# Altium project BY-IOM-v0.2.PrjPCB
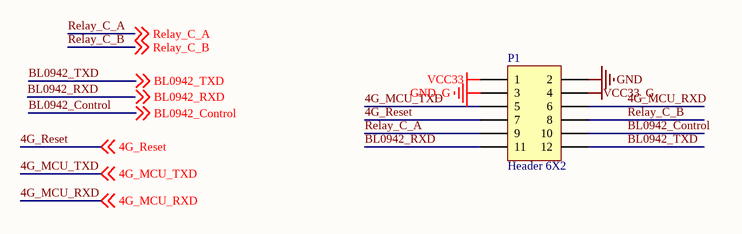
[diagram p0: 连接.SchDoc]
4 sheets, 54 parts. Net scope: global (net labels, ports and power ports of the same name join across sheets).
Board file: Power.PcbDoc
Sheets:
  连接.SchDoc
  Power.SchDoc
  继电器.SchDoc
  4G.SchDoc

## Sheet 连接.SchDoc
size A4

### Parts
P1  Header 6X2  [HDR2X6]

### Nets
GND: P1.2
GND_G: P1.3
VCC33: P1.1
VCC33_G: P1.4
4G_MCU_RXD: P1.6 ; off-sheet 4G_MCU_RXD
4G_MCU_TXD: P1.5 ; off-sheet 4G_MCU_TXD
4G_Reset: P1.7 ; off-sheet 4G_Reset
BL0942_Control: P1.10 ; off-sheet BL0942_Control
BL0942_RXD: P1.11 ; off-sheet BL0942_RXD
BL0942_TXD: P1.12 ; off-sheet BL0942_TXD
Relay_C_A: P1.9 ; off-sheet Relay_C_A
Relay_C_B: P1.8 ; off-sheet Relay_C_B

### Notes on the sheet
- Labels drawn without touching a wire or pin: BL0942_RXD

### Library data of the parts
P1 = Header 6X2: Header, 6-Pin, Dual row; LatestRevisionDate: 17-Jul-2002; LatestRevisionNote: Re-released for DXP Platform.; Publisher: Altium Limited

## Sheet Power.SchDoc
size A4
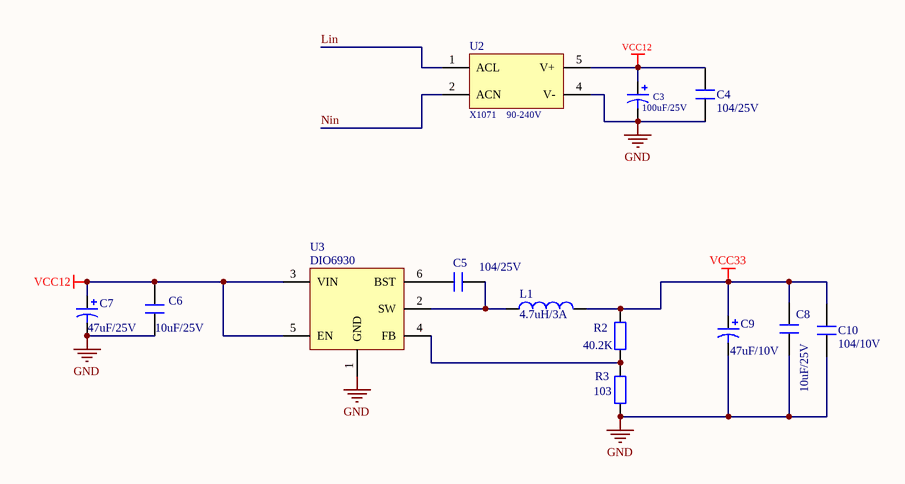
[diagram p1: Power.SchDoc]

### Parts
C3  100uF/25V  [CAPPIND06]
C4  104/25V  [0603R]
C5  104/25V  [0603R]
C6  10uF/25V  [0603R]
C7  47uF/25V  [0805R]
C8  10uF/25V  [0603R]
C9  47uF/10V  [0805R]
C10  104/10V  [0603R]
L1  4.7uH/3A  [贴片电感5020]
R2  40.2K  [0603R]
R3  103  [0603R]
U2  X1071    90-240V  [X1071]
U3  DIO6930  [SOT-23-6DBV]

### Nets
GND: C3.2 C4.1 C6.1 C7.2 C8.1 C9.2 C10.1 R3.2 U2.4(V-) U3.1(GND)
VCC12: C3.1 C4.2 C6.2 C7.1 U2.5(V+) U3.3(VIN) U3.5(EN)
VCC33: C8.2 C9.1 C10.2 L1.2 R2.1
Lin: U2.1(ACL)
Nin: U2.2(ACN)
NetC5_1: C5.1 L1.1 U3.2(SW)
NetC5_2: C5.2 U3.6(BST)
NetR2_2: R2.2 R3.1 U3.4(FB)

### Library data of the parts
C3 C7 C9 = Cap Pol1: Polarized Capacitor (Radial); Published: 8-Jun-2000; LatestRevisionDate: 17-Jul-2002; LatestRevisionNote: Re-released for DXP Platform.; PackageReference: RB7.6-15; Publisher: Altium Limited; PackageDescription: Polarized Capacitor (Radial); 2 Leads
C4 C5 C10 = CAP_1
C6 C8 = CAP
L1 = Inductor: Code_IEC: 1005; Published: 8-Jun-2000; LatestRevisionDate: 29-May-2009; LatestRevisionNote: IPC-7351 Footprint Added.; PackageReference: 0402-A; Publisher: Altium Limited; PackageDescription: Chip Inductor; Code_JEITA: 0402
R2 R3 = Res2: Resistor; Published: 8-Jun-2000; LatestRevisionDate: 17-Jul-2002; LatestRevisionNote: Re-released for DXP Platform.; PackageReference: AXIAL-0.4; Publisher: Altium Limited; PackageDescription: Axial Device, Thru-Hole; 2 Leads; 0.4 in Pin Spacing
U2 = AD2DC_EMC
U3 = BL8032

## Sheet 继电器.SchDoc
size A4
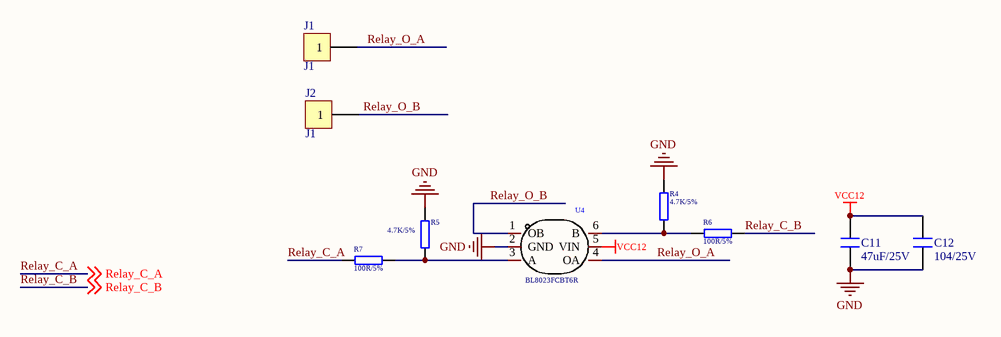
[diagram p2: 继电器.SchDoc]

### Parts
C11  47uF/25V  [0603R]
C12  104/25V  [0603R]
J1  J1  [贴片焊盘V1（3*2椭圆）]
J2  J1  [贴片焊盘V1（3*2椭圆）]
R4  4.7K/5%  [0603R]
R5  4.7K/5%  [0603R]
R6  100R/5%  [0603R]
R7  100R/5%  [0603R]
U4  BL8023FCBT6R  [SOT-23-6]

### Nets
GND: C11.1 C12.1 R4.1 R5.1 U4.2(GND)
VCC12: C11.2 C12.2 U4.5(VIN)
Relay_C_A: R7.2 ; off-sheet Relay_C_A
Relay_C_B: R6.1 ; off-sheet Relay_C_B
Relay_O_A: J1.1 U4.4(OA)
Relay_O_B: J2.1 U4.1(OB)
NetR4_2: R4.2 R6.2 U4.6(B)
NetR5_2: R5.2 R7.1 U4.3(A)

### Library data of the parts
C11 C12 = CAP_1
R4-R7 = RES
U4 = BL8023HCB6TR: Manufacturer: BL(上海贝岭); Add into BOM: yes; Symbol: BL8023HCB6TR; Device: BL8023HCB6TR; Supplier: LCSC; Supplier Part: C431145; Manufacturer Part: BL8023HCB6TR; JLCPCB Part Class: Extended Part; LCSC Part Name: BL8023HCB6TR 继电器驱动芯片 停产; Supplier Footprint: SOT-23-6; Datasheet: https://atta.szlcsc.com/upload/public/pdf/source/20190920/C431145_DEC39E836DB2A2F1462A8BB350F12ABB.pdf; Convert to PCB: yes

## Sheet 4G.SchDoc
size A2
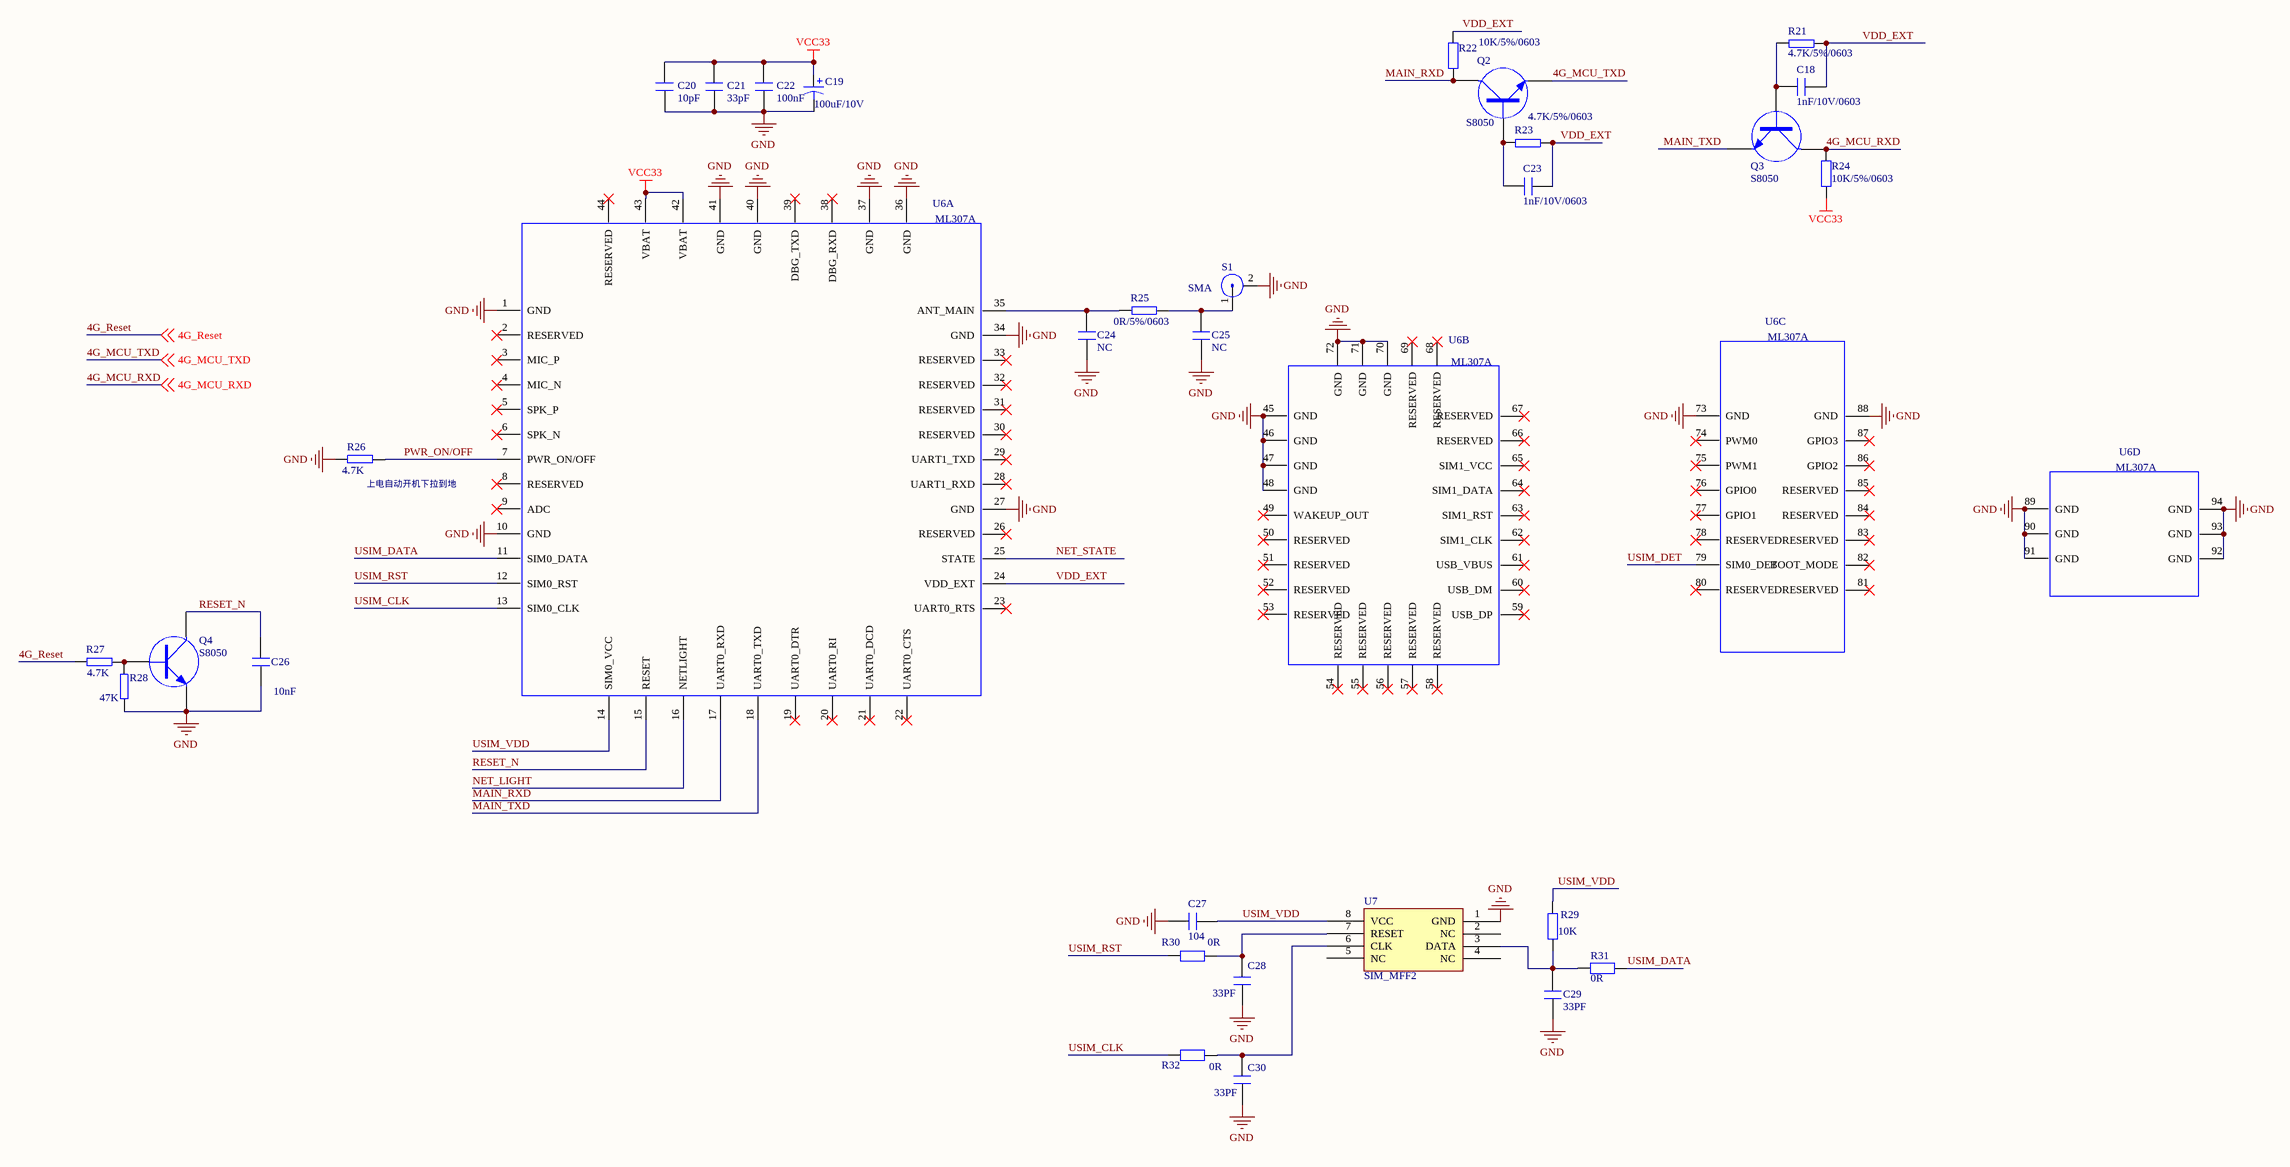
[diagram p3: 4G.SchDoc]

### Parts
C18  1nF/10V/0603  [0603R]
C19  100uF/10V  [C1210]
C20  10pF  [0603R]
C21  33pF  [0603R]
C22  100nF  [0603R]
C23  1nF/10V/0603  [0603R]
C24  NC  [0603R]
C25  NC  [0603R]
C26  10nF  [0603R]
C27  104  [0603R]
C28  33PF  [0603R]
C29  33PF  [0603R]
C30  33PF  [0603R]
Q2  S8050  [SOT-23]
Q3  S8050  [SOT-23]
Q4  S8050  [SOT-23]
R21  4.7K/5%/0603  [0603R]
R22  10K/5%/0603  [0603R]
R23  4.7K/5%/0603  [0603R]
R24  10K/5%/0603  [0603R]
R25  0R/5%/0603  [0603R]
R26  4.7K  [0603R]
R27  4.7K  [0603R]
R28  47K  [0603R]
R29  10K  [0603R]
R30  0R  [0603R]
R31  0R  [0603R]
R32  0R  [0603R]
S1  SMA  [RF1-00283天线座]
U6  ML307A  [ML307A]  (parts A,B,C,D of 4)
U7  SIM_MFF2  [VQFN8]

### Nets
GND: C19.2 C20.2 C21.2 C22.2 C24.1 C25.1 C26.1 C27.1 C28.2 C29.1 C30.2 Q4.2(E) R26.2 R28.2 S1.2 U6.1(GND) U6.10(GND) U6.27(GND) U6.34(GND) U6.36(GND) U6.37(GND) U6.40(GND) U6.41(GND) U6.45(GND) U6.46(GND) U6.47(GND) U6.48(GND) U6.70(GND) U6.71(GND) U6.72(GND) U6.73(GND) U6.88(GND) U6.89(GND) U6.90(GND) U6.91(GND) U6.92(GND) U6.93(GND) U6.94(GND) U7.1(GND)
VCC33: C19.1 C20.1 C21.1 C22.1 R24.2 U6.42(VBAT) U6.43(VBAT)
4G_MCU_RXD: Q3.3(C) R24.1 ; off-sheet 4G_MCU_RXD
4G_MCU_TXD: Q2.2(E) ; off-sheet 4G_MCU_TXD
4G_Reset: R27.1 ; off-sheet 4G_Reset
MAIN_RXD: Q2.3(C) R22.2 U6.17(UART0_RXD)
MAIN_TXD: Q3.2(E) U6.18(UART0_TXD)
NET_LIGHT: U6.16(NETLIGHT)
NET_STATE: U6.25(STATE)
PWR_ON/OFF: R26.1 U6.7(PWR_ON/OFF)
RESET_N: C26.2 Q4.3(C) U6.15(RESET)
USIM_CLK: R32.2 U6.13(SIM0_CLK)
USIM_DATA: R31.1 U6.11(SIM0_DATA)
USIM_DET: U6.79(SIM0_DET)
USIM_RST: R30.2 U6.12(SIM0_RST)
USIM_VDD: C27.2 R29.1 U6.14(SIM0_VCC) U7.8(VCC)
VDD_EXT: C18.2 C23.2 R21.2 R22.1 R23.2 U6.24(VDD_EXT)
NetC18_1: C18.1 Q3.1(B) R21.1
NetC23_1: C23.1 Q2.1(B) R23.1
NetC24_2: C24.2 R25.1 U6.35(ANT_MAIN)
NetC25_2: C25.2 R25.2 S1.1
NetC28_1: C28.1 R30.1 U7.7(RESET)
NetC29_2: C29.2 R29.2 R31.2 U7.3(DATA)
NetC30_1: C30.1 R32.1 U7.6(CLK)
NetQ4_1: Q4.1(B) R27.2 R28.1

Not connected (* = marked no-connect by the designer): U6 2(RESERVED)* 3(MIC_P)* 4(MIC_N)* 5(SPK_P)* 6(SPK_N)* 8(RESERVED)* 9(ADC)* 19(UART0_DTR)* 20(UART0_RI)* 21(UART0_DCD)* 22(UART0_CTS)* 23(UART0_RTS)* 26(RESERVED)* 28(UART1_RXD)* 29(UART1_TXD)* 30(RESERVED)* 31(RESERVED)* 32(RESERVED)* 33(RESERVED)* 38(DBG_RXD)* 39(DBG_TXD)* 44(RESERVED)* 49(WAKEUP_OUT)* 50(RESERVED)* 51(RESERVED)* 52(RESERVED)* 53(RESERVED)* 54(RESERVED)* 55(RESERVED)* 56(RESERVED)* 57(RESERVED)* 58(RESERVED)* 59(USB_DP)* 60(USB_DM)* 61(USB_VBUS)* 62(SIM1_CLK)* 63(SIM1_RST)* 64(SIM1_DATA)* 65(SIM1_VCC)* 66(RESERVED)* 67(RESERVED)* 68(RESERVED)* 69(RESERVED)* 74(PWM0)* 75(PWM1)* 76(GPIO0)* 77(GPIO1)* 78(RESERVED)* 80(RESERVED)* 81(RESERVED)* 82(BOOT_MODE)* 83(RESERVED)* 84(RESERVED)* 85(RESERVED)* 86(GPIO2)* 87(GPIO3)*; U7 2(NC) 4(NC) 5(NC)

### Notes on the sheet
- (near R26) 上电自动开机下拉到地

### Library data of the parts
C18 C23-C25 C27-C30 = CAP
C19 = Cap Pol1: Polarized Capacitor (Radial); Published: 8-Jun-2000; LatestRevisionDate: 17-Jul-2002; LatestRevisionNote: Re-released for DXP Platform.; PackageReference: RB7.6-15; Publisher: Altium Limited; PackageDescription: Polarized Capacitor (Radial); 2 Leads
C20-C22 C26 = CAP_1
Q2-Q4 = NPN
R21 R23 R25-R28 = RES
R22 R24 R29-R32 = Res2: Resistor; Published: 8-Jun-2000; LatestRevisionDate: 17-Jul-2002; LatestRevisionNote: Re-released for DXP Platform.; PackageReference: AXIAL-0.4; Publisher: Altium Limited; PackageDescription: Axial Device, Thru-Hole; 2 Leads; 0.4 in Pin Spacing
U6 = ML307A: PCB DECAL: MOD_ML307

## Nets that join several sheets
GND: 连接 (P1.2), Power (10 pins), 继电器 (5 pins), 4G (39 pins)
VCC12: Power (7 pins), 继电器 (C11.2 C12.2 U4.5)
VCC33: 连接 (P1.1), Power (5 pins), 4G (7 pins)
4G_MCU_RXD: 连接 (P1.6), 4G (Q3.3 R24.1)
4G_MCU_TXD: 连接 (P1.5), 4G (Q2.2)
4G_Reset: 连接 (P1.7), 4G (R27.1)
Relay_C_A: 连接 (P1.9), 继电器 (R7.2)
Relay_C_B: 连接 (P1.8), 继电器 (R6.1)